# Altium schematic sheet Sheet_1_2021-11-09.schdoc
size 54 x 65 mm
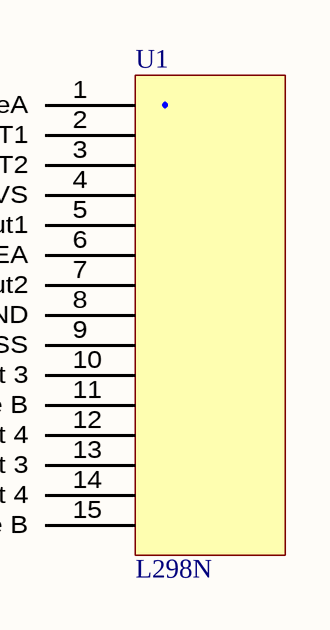
[diagram p0: Sheet_1_2021-11-09.schdoc]

## Parts
U1  L298N

## Nets

Not connected (* = marked no-connect by the designer): U1 1(SenseA) 2(OUT1) 3(OUT2) 4(VS) 5(Input1) 6(ENABLEA) 7(Input2) 8(GND) 9(VSS) 10(Input_3) 11(Enable_B) 12(Input_4) 13(Out_3) 14(Out_4) 15(Sense_B)